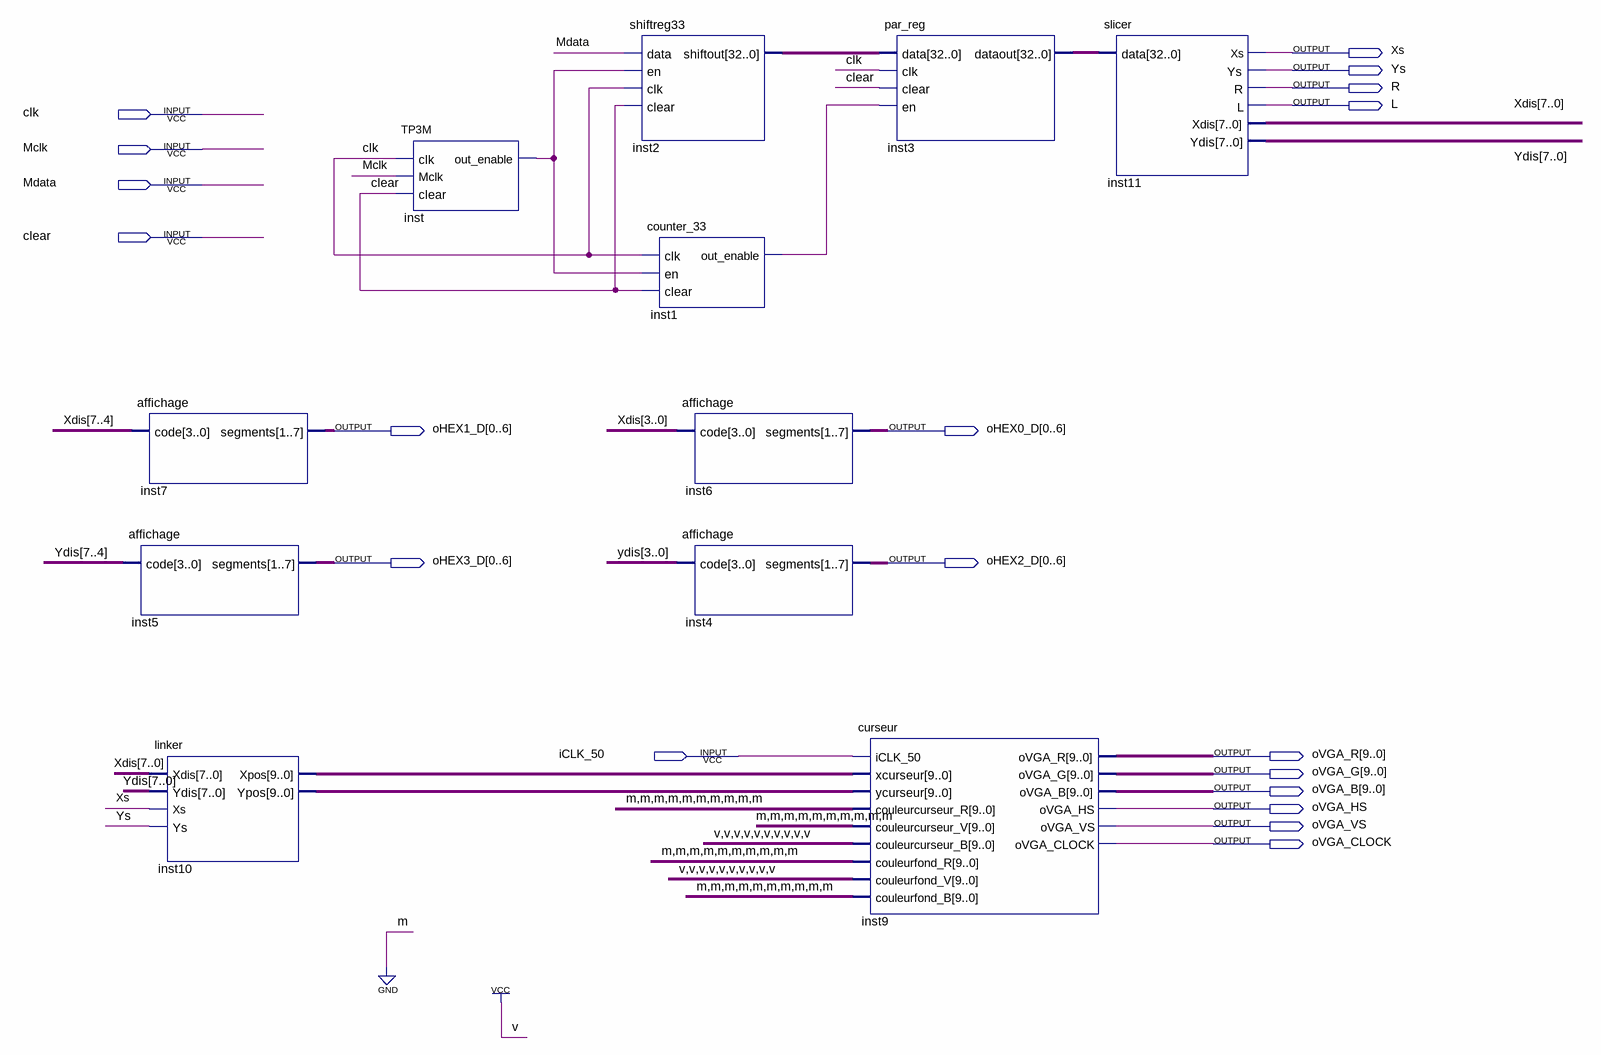
[diagram p0: schematic sheet]
// Quartus schematic mouse_interface.bdf as structural Verilog: 11 symbols, 19 pins
module mouse_interface (
  input  clk,
  input  Mclk,
  input  Mdata,
  input  clear,
  input  iCLK_50,
  output Xs,
  output Ys,
  output R,
  output L,
  output [0:6] oHEX1_D,
  output [0:6] oHEX0_D,
  output [0:6] oHEX3_D,
  output [0:6] oHEX2_D,
  output [9:0] oVGA_R,
  output [9:0] oVGA_G,
  output [9:0] oVGA_B,
  output oVGA_HS,
  output oVGA_VS,
  output oVGA_CLOCK
);

  wire inst1_out_enable, inst_out_enable;
  wire [7:0] Xdis, Ydis;
  wire [9:0] inst10_xpos, inst10_ypos;
  wire [32:0] inst2_shiftout, inst3_dataout;

  affichage inst7 (.code(Xdis[7:4]), .segments(oHEX1_D));
  affichage inst5 (.code(Ydis[7:4]), .segments(oHEX3_D));
  linker inst10 (.Xdis(Xdis), .Ydis(Ydis), .Xs(Xs), .Ys(Ys), .Xpos(inst10_xpos), .Ypos(inst10_ypos));
  TP3M inst (.clk(clk), .Mclk(Mclk), .clear(clear), .out_enable(inst_out_enable));
  shiftreg33 inst2 (.data(Mdata), .en(inst_out_enable), .clk(clk), .clear(clear), .shiftout(inst2_shiftout));
  counter_33 inst1 (.clk(clk), .en(inst_out_enable), .clear(clear), .out_enable(inst1_out_enable));
  affichage inst6 (.code(Xdis[3:0]), .segments(oHEX0_D));
  affichage inst4 (.code(Ydis[3:0]), .segments(oHEX2_D));
  curseur inst9 (
    .iCLK_50(iCLK_50), .xcurseur(inst10_xpos), .ycurseur(inst10_ypos), .couleurcurseur_R({10{1'b0}}),
    .couleurcurseur_V({10{1'b0}}), .couleurcurseur_B({10{1'b1}}), .couleurfond_R({10{1'b0}}),
    .couleurfond_V({10{1'b1}}), .couleurfond_B({10{1'b0}}), .oVGA_R(oVGA_R), .oVGA_G(oVGA_G),
    .oVGA_B(oVGA_B), .oVGA_HS(oVGA_HS), .oVGA_VS(oVGA_VS), .oVGA_CLOCK(oVGA_CLOCK));
  par_reg inst3 (.data(inst2_shiftout), .clk(clk), .clear(clear), .en(inst1_out_enable), .dataout(inst3_dataout));
  slicer inst11 (.data(inst3_dataout), .Xs(Xs), .Ys(Ys), .R(R), .L(L), .Xdis(Xdis), .Ydis(Ydis));
endmodule
